# Altium schematic sheet [0]- Block Diagram.SchDoc: RK3399 SOM Board Design V1.0
size A4; Author: AVIRAL MISHRA; DocumentNumber: 1; SheetNumber: 1; SheetTotal: 12; PROJECT CODE: A_V1.0
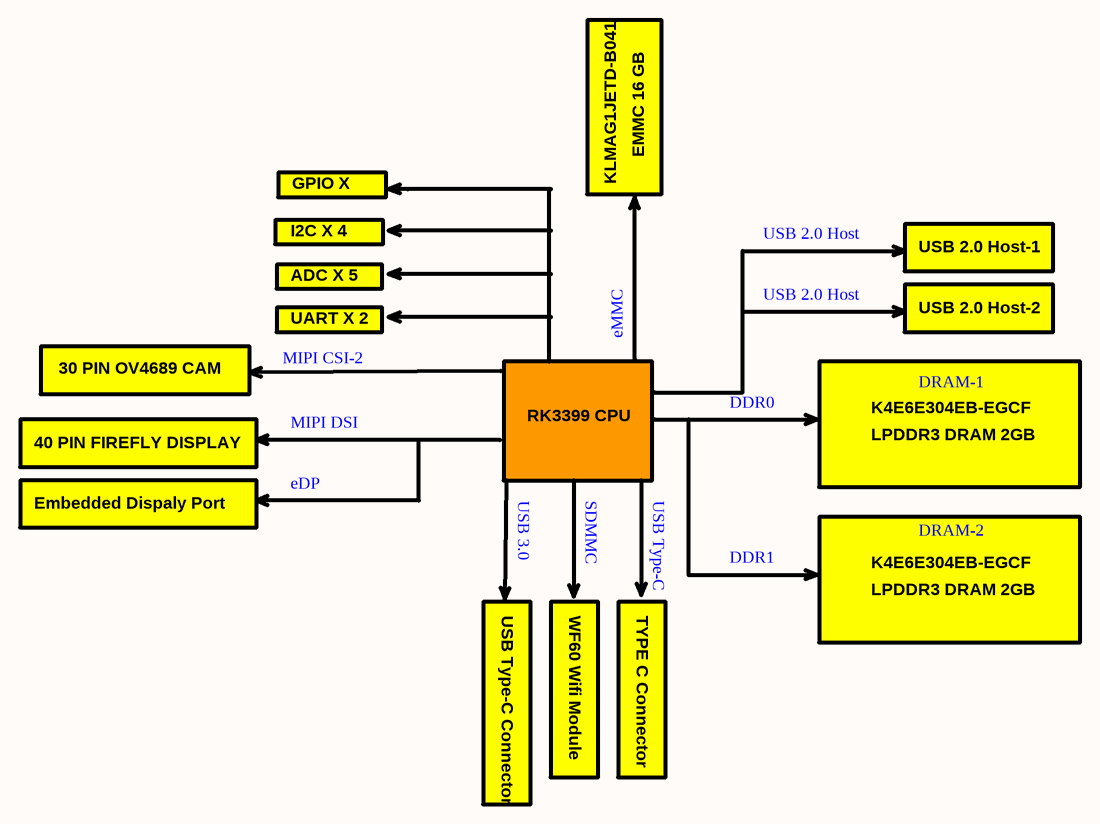
[diagram p0: [0]- Block Diagram.SchDoc]

## Notes on the sheet
- GPIO X
- KLMAG1JETD-B041
- EMMC 16 GB
- I2C X 4
- USB 2.0 Host
- USB 2.0 Host-1
- ADC X 5
- UART X 2
- eMMC
- USB 2.0 Host-2
- 30 PIN OV4689 CAM
- MIPI CSI-2
- DRAM-1
- 40 PIN FIREFLY DISPLAY
- MIPI DSI
- RK3399 CPU
- DDR0
- K4E6E304EB-EGCF
- LPDDR3 DRAM 2GB
- Embedded Dispaly Port
- eDP
- USB 3.0
- SDMMC
- USB Type-C
- DRAM-2
- DDR1
- USB Type-C Connector
- WF60 Wifi Module
- TYPE C Connector
- TITLE:
- DOCUMENT NAME:
- SCALE 1:1
- This document is copyright of EsteemPCB and shall not be revealed, produced, copied, in whole or in part, nor
- PROJECT CODE:
- TEMPLATE:
- A4
- AUTHOR:
- Sheet
- of
- used for any purpose other than submitted.